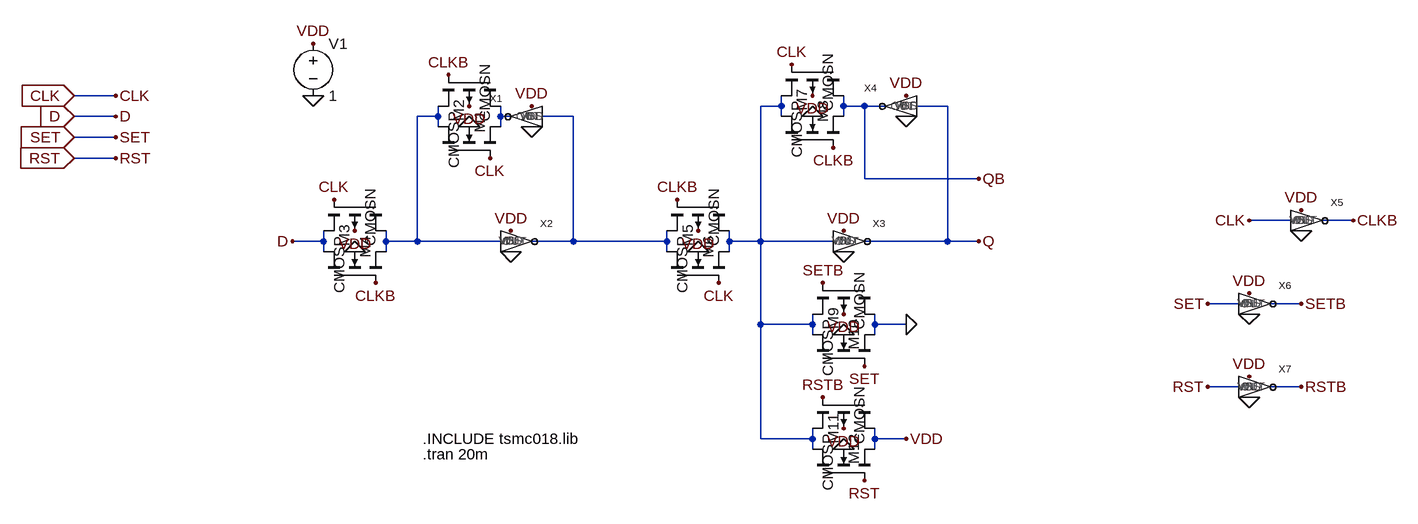
[diagram p0: schematic smj_dff_x1.asc]
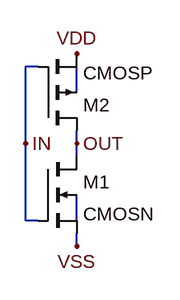
[diagram p1: sub-circuit inv_x1.asc]
smj_dff_x1.asc, the LTspice schematic file:
Version 4
SHEET 1 1408 932
WIRE -528 96 -592 96
WIRE 496 112 496 96
WIRE 496 112 464 112
WIRE 592 112 592 96
WIRE 624 112 592 112
WIRE 656 112 624 112
WIRE 752 112 704 112
WIRE -528 128 -592 128
WIRE -32 128 -32 112
WIRE -32 128 -64 128
WIRE 64 128 64 112
WIRE 80 128 64 128
WIRE 176 128 128 128
WIRE 496 128 496 112
WIRE 592 128 592 112
WIRE -32 144 -32 128
WIRE 64 144 64 128
WIRE -528 160 -592 160
WIRE -528 192 -592 192
WIRE 624 224 624 112
WIRE 800 224 624 224
WIRE 1280 288 1216 288
WIRE 1376 288 1328 288
WIRE -208 320 -208 304
WIRE -208 320 -256 320
WIRE -112 320 -112 304
WIRE -64 320 -64 128
WIRE -64 320 -112 320
WIRE 64 320 -64 320
WIRE 176 320 176 128
WIRE 176 320 112 320
WIRE 320 320 320 304
WIRE 320 320 176 320
WIRE 416 320 416 304
WIRE 464 320 464 112
WIRE 464 320 416 320
WIRE 576 320 464 320
WIRE 752 320 752 112
WIRE 752 320 624 320
WIRE 800 320 752 320
WIRE -208 336 -208 320
WIRE -112 336 -112 320
WIRE 320 336 320 320
WIRE 416 336 416 320
WIRE 1200 416 1152 416
WIRE 1296 416 1248 416
WIRE 464 448 464 320
WIRE 544 448 544 432
WIRE 544 448 464 448
WIRE 640 448 640 432
WIRE 688 448 640 448
WIRE 544 464 544 448
WIRE 640 464 640 448
WIRE 1200 544 1152 544
WIRE 1296 544 1248 544
WIRE 464 624 464 448
WIRE 544 624 544 608
WIRE 544 624 464 624
WIRE 640 624 640 608
WIRE 688 624 640 624
WIRE 544 640 544 624
WIRE 640 640 640 624
FLAG -192 256 CLK
FLAG 48 192 CLK
FLAG 576 176 CLKB
FLAG 400 384 CLK
FLAG -16 64 CLKB
FLAG -128 384 CLKB
FLAG 336 256 CLKB
FLAG 512 48 CLK
FLAG -256 320 D
FLAG 800 320 Q
FLAG 800 224 QB
FLAG 1376 288 CLKB
FLAG 1216 288 CLK
FLAG 1296 272 VDD
FLAG 1296 304 0
FLAG -224 96 0
FLAG -224 16 VDD
FLAG 16 144 0
FLAG -160 336 0
FLAG 368 336 0
FLAG 544 128 0
FLAG 16 112 VDD
FLAG -160 304 VDD
FLAG 368 304 VDD
FLAG 544 96 VDD
FLAG 624 512 SET
FLAG 560 384 SETB
FLAG 592 464 0
FLAG 592 432 VDD
FLAG 624 688 RST
FLAG 560 560 RSTB
FLAG 592 640 0
FLAG 592 608 VDD
FLAG 688 448 0
FLAG 688 624 VDD
FLAG 1216 400 VDD
FLAG 1216 432 0
FLAG 1152 416 SET
FLAG 1296 416 SETB
FLAG 1216 528 VDD
FLAG 1216 560 0
FLAG 1152 544 RST
FLAG 1296 544 RSTB
FLAG 112 112 VDD
FLAG 80 304 VDD
FLAG 592 304 VDD
FLAG 688 96 VDD
FLAG 112 144 0
FLAG 80 336 0
FLAG 592 336 0
FLAG 688 128 0
FLAG -592 96 CLK
IOPIN -592 96 In
FLAG -592 128 D
IOPIN -592 128 In
FLAG -592 160 SET
IOPIN -592 160 In
FLAG -592 192 RST
IOPIN -592 192 In
FLAG -528 96 CLK
FLAG -528 128 D
FLAG -528 160 SET
FLAG -528 192 RST
SYMBOL cmosn -32 192 R270
SYMATTR InstName M2
SYMATTR Value2 l=180n w=1u
SYMBOL cmosp 64 64 R90
SYMATTR InstName M1
SYMATTR Value2 l=180n w=5u
SYMBOL cmosn -208 384 R270
SYMATTR InstName M3
SYMATTR Value2 l=180n w=1u
SYMBOL cmosp -112 256 R90
SYMATTR InstName M4
SYMATTR Value2 l=180n w=5u
SYMBOL cmosn 320 384 R270
SYMATTR InstName M5
SYMATTR Value2 l=180n w=1u
SYMBOL cmosp 416 256 R90
SYMATTR InstName M6
SYMATTR Value2 l=180n w=5u
SYMBOL cmosn 496 176 R270
SYMATTR InstName M7
SYMATTR Value2 l=180n w=1u
SYMBOL cmosp 592 48 R90
SYMATTR InstName M8
SYMATTR Value2 l=180n w=5u
SYMBOL inv_x1 1312 288 R0
SYMATTR InstName X5
SYMBOL voltage -224 0 R0
WINDOW 123 0 0 Left 0
WINDOW 39 0 0 Left 0
SYMATTR InstName V1
SYMATTR Value 1
SYMBOL cmosn 544 512 R270
SYMATTR InstName M9
SYMATTR Value2 l=180n w=1u
SYMBOL cmosp 640 384 R90
SYMATTR InstName M10
SYMATTR Value2 l=180n w=5u
SYMBOL cmosn 544 688 R270
SYMATTR InstName M11
SYMATTR Value2 l=180n w=1u
SYMBOL cmosp 640 560 R90
SYMATTR InstName M12
SYMATTR Value2 l=180n w=5u
SYMBOL inv_x1 1232 416 R0
SYMATTR InstName X6
SYMBOL inv_x1 1232 544 R0
SYMATTR InstName X7
SYMBOL inv_x1 96 128 M0
SYMATTR InstName X1
SYMBOL inv_x1 96 320 R0
SYMATTR InstName X2
SYMBOL inv_x1 608 320 R0
SYMATTR InstName X3
SYMBOL inv_x1 672 112 M0
SYMATTR InstName X4
TEXT -56 648 Left 2 !.tran 20m
TEXT -56 624 Left 2 !.INCLUDE tsmc018.lib

inv_x1.asc, the sub-circuit schematic file:
Version 4
SHEET 1 880 680
WIRE 160 48 144 48
WIRE 208 80 208 48
WIRE 144 144 144 48
WIRE 208 144 208 128
WIRE 208 160 208 144
WIRE 144 240 144 144
WIRE 160 240 144 240
WIRE 208 240 208 208
WIRE 208 272 208 256
FLAG 208 32 VDD
FLAG 208 272 VSS
FLAG 144 144 IN
FLAG 208 144 OUT
SYMBOL cmosn 160 160 R0
SYMATTR InstName M1
SYMATTR Value2 l=180nm w=1um
SYMBOL cmosp 160 128 M180
SYMATTR InstName M2
SYMATTR Value2 l=180nm w=5um

The netlist it stands for:
* smj_dff_x1.asc
M2 N002 CLK N003 0 CMOSN l=180n w=1u
M1 N003 CLKB N002 VDD CMOSP l=180n w=5u
M3 D CLKB N002 0 CMOSN l=180n w=1u
M4 N002 CLK D VDD CMOSP l=180n w=5u
M5 N004 CLK N001 0 CMOSN l=180n w=1u
M6 N001 CLKB N004 VDD CMOSP l=180n w=5u
M7 N001 CLKB QB 0 CMOSN l=180n w=1u
M8 QB CLK N001 VDD CMOSP l=180n w=5u
XX5 CLK CLKB VDD 0 inv_x1
V1 VDD 0 1
M9 N001 SET 0 0 CMOSN l=180n w=1u
M10 0 SETB N001 VDD CMOSP l=180n w=5u
M11 N001 RST VDD 0 CMOSN l=180n w=1u
M12 VDD RSTB N001 VDD CMOSP l=180n w=5u
XX6 SET SETB VDD 0 inv_x1
XX7 RST RSTB VDD 0 inv_x1
XX1 N004 N003 VDD 0 inv_x1
XX2 N002 N004 VDD 0 inv_x1
XX3 N001 Q VDD 0 inv_x1
XX4 Q QB VDD 0 inv_x1

* block symbol definitions
.subckt inv_x1 IN OUT VDD VSS
M1 OUT IN VSS N002 CMOSN l=180nm w=1um
M2 OUT IN VDD N001 CMOSP l=180nm w=5um
.ends inv_x1

.model NMOS NMOS
.model PMOS PMOS
.lib standard.mos
.tran 20m
.INCLUDE tsmc018.lib
.backanno
.end